# EAGLE design DRV8825 (EAGLE 7.2.0)
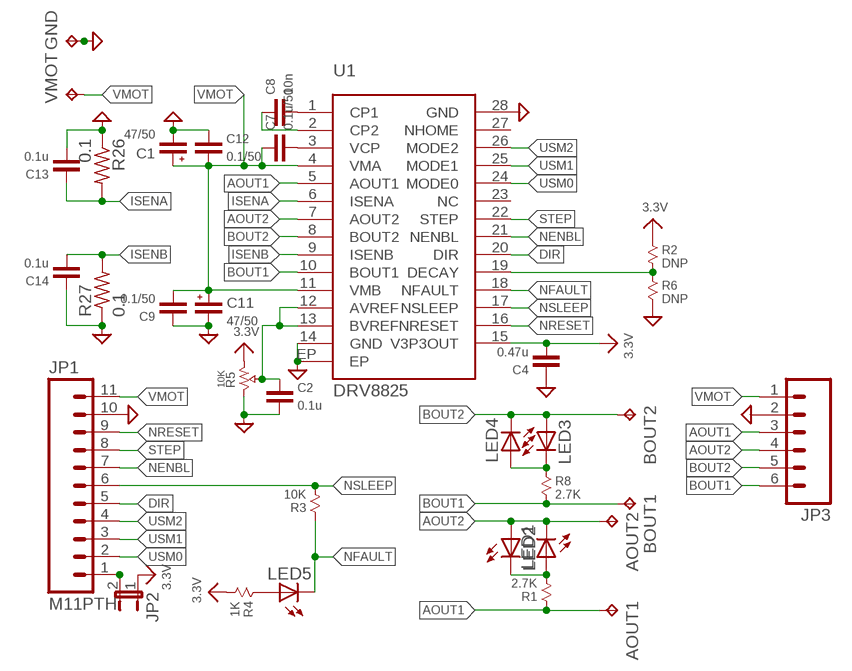
[diagram p0: schematic, sheet 1]

## Parts
AOUT1  TPTP18R  [TP18R]
AOUT2  TPTP18R  [TP18R]
BOUT1  TPTP18R  [TP18R]
BOUT2  TPTP18R  [TP18R]
C1  47/50  CAP-POL-7343  [CT7343]
C2  0.1u  CAP-0603  [0603]
C4  0.47u  CAP-0603  [0603]
C7  0.1u/50  CAP-0603  [0603]
C8  10n  CAP-0603  [0603]
C9  0.1/50  CAP-0603  [0603]
C11  47/50  CAP-POL-7343  [CT7343]
C12  0.1/50  CAP-0603  [0603]
C13  0.1u  CAP-0603  [0603]
C14  0.1u  CAP-0603  [0603]
GND  TPTP18R  [TP18R]
JP1  M11PTH  [1X11]
JP2  JUMPER-2SMD-NO  [SJ_2S-NO]
JP3  M06SIP  [1X06]
LED1  LEDCHIP-LED0603  [CHIP-LED0603]
LED2  LEDCHIP-LED0603  [CHIP-LED0603]
LED3  LEDCHIP-LED0603  [CHIP-LED0603]
LED4  LEDCHIP-LED0603  [CHIP-LED0603]
LED5  LEDCHIP-LED0603  [CHIP-LED0603]
R1  2.7K  RESISTOR-0603  [0603]
R2  DNP  RESISTOR-0603  [0603]
R3  10K  RESISTOR-0603  [0603]
R4  1K  RESISTOR-0603  [0603]
R5  10K  PVZ3A  [PVZ3A]
R6  DNP  RESISTOR-0603  [0603]
R8  2.7K  RESISTOR-0603  [0603]
R26  0.1  R-US_R2512  [R2512]
R27  0.1  R-US_R2512  [R2512]
U1  DRV8825  [SSOP28EP]
VMOT  TPTP18R  [TP18R]

## Nets
3.3V: C4.1 JP2.1 R2.1 R4.2 R5.3 U1.15(V3P3OUT)
AOUT1: AOUT1.TP JP3.3 R1.1 U1.5(AOUT1)
AOUT2: AOUT2.TP JP3.4 LED1.C LED2.A U1.7(AOUT2)
BOUT1: BOUT1.TP JP3.6 R8.2 U1.10(BOUT1)
BOUT2: BOUT2.TP JP3.5 LED3.A LED4.C U1.8(BOUT2)
DIR: JP1.5 U1.20(DIR)
GND: C1.- C2.1 C4.2 C9.2 C11.- C12.2 C13.1 C14.2 GND.TP JP1.10 JP3.2 R5.1 R6.2 R26.1 R27.1 U1.14(GND) U1.28(GND) U1.EP
ISENA: C13.2 R26.2 U1.6(ISENA)
ISENB: C14.1 R27.2 U1.9(ISENB)
N$1: C8.1 U1.1(CP1)
N$2: LED3.C LED4.A R8.1
N$3: LED1.A LED2.C R1.2
N$4: C8.2 U1.2(CP2)
N$5: LED5.A R4.1
N$7: C7.1 U1.3(VCP)
N$8: C2.2 R5.2 U1.12(AVREF) U1.13(BVREF)
N$12: R2.2 R6.1 U1.19(DECAY)
N$15: JP1.1 JP2.2
NENBL: JP1.7 U1.21(NENBL)
NFAULT: LED5.C R3.1 U1.18(NFAULT)
NRESET: JP1.9 U1.16(NRESET)
NSLEEP: JP1.6 R3.2 U1.17(NSLEEP)
STEP: JP1.8 U1.22(STEP)
USM0: JP1.2 U1.24(MODE0)
USM1: JP1.3 U1.25(MODE1)
USM2: JP1.4 U1.26(MODE2)
VMOT: C1.+ C7.2 C9.1 C11.+ C12.1 JP1.11 JP3.1 U1.4(VMA) U1.11(VMB) VMOT.TP
Unconnected: U1.23(NC) U1.27(NHOME)

## Library data of the parts
AOUT1 AOUT2 BOUT1 BOUT2 GND VMOT = testpad:TP: Test pad
C1 C11 = X893:CAP-POL
C2 C4 C7-C9 C12-C14 = X893:CAP: Capacitor
JP1 = SparkFun:M11: Header 11 Standard 11-pin 0.1" header. Use with straight break away headers (SKU : PRT-00116), right angle break away headers (PRT-00553), swiss pins (PRT-00743), machine pins (PRT-00117), and female headers (PRT-00115).
JP2 = SparkFun:JUMPER-2: Jumper Basic 0.1" spaced jumper. Use with breakaway headers.
JP3 = SparkFun:M06: Header 6 Standard 6-pin 0.1" header. Use with straight break away headers (SKU : PRT-00116), right angle break away headers (PRT-00553), swiss pins (PRT-00743), machine pins (PRT-00117), and female headers (PRT-00115). Molex polarized connector foot print use with SKU : PRT-08094 with associated crimp pins and housings. NOTES ON THE VARIANTS LOCK and LOCK_LONGPADS... This footprint was designed to help hold the alignment of a through-hole component (i.e. 6-pin header) while soldering it into place. You may notice that each hole has been shifted either up or down by 0.005 of an inch from it's more standard position (which is a perfectly straight line). This slight alteration caused the pins (the squares in the middle) to touch the edges of the holes. Because they are alternating, it causes a "brace" to hold the component in place. 0.005 has proven to be the perfect amount of "off-center" position when using our standard breakaway headers. Although looks a little odd when you look at the bare footprint, once you have a header in there, the alteration is very hard to notice. Also, if you push a header all the way into place, it is covered up entirely on the bottom side. This idea of altering the position of holes to aid alignment will be further integrated into the Sparkfun Library for other footprints. It can help hold any component with 3 or more connection pins.
LED1-LED5 = led:LED: LED OSRAM: - CHIPLED LG R971, LG N971, LY N971, LG Q971, LY Q971, LO R971, LY R971 LH N974, LH R974 LS Q976, LO Q976, LY Q976 LO Q996 - Hyper CHIPLED LW Q18S LB Q993, LB Q99A, LB R99A - SideLED LS A670, LO A670, LY A670, LG A670, LP A670 LB A673, LV A673, LT A673, LW A673 LH A674 LY A675 LS A676, LA A676, LO A676, LY A676, LW A676 LS A679, LY A679, LG A679 - Hyper Micro SIDELED® LS Y876, LA Y876, LO Y876, LY Y876 LT Y87S - SmartLED LW L88C, LW L88S LB L89C, LB L89S, LG L890 LS L89K, LO L89K, LY L89K LS L896, LA L896, LO L896, LY L896 - TOPLED LS T670, LO T670, LY T670, LG T670, LP T670 LSG T670, LSP T670, LSY T670, LOP T670, LYG T670 LG T671, LOG T671, LSG T671 LB T673, LV T673, LT T673, LW T673 LH T674 LS T676, LA T676, LO T676, LY T676, LB T676, LH T676, LSB T676, LW T676 LB T67C, LV T67C, LT T67C, LS T67K, LO T67K, LY T67K, LW E67C LS E67B, LA E67B, LO E67B, LY E67B, LB E67C, LV E67C, LT E67C LW T67C LS T679, LY T679, LG T679 LS T770, LO T770, LY T770, LG T770, LP T770 LB T773, LV T773, LT T773, LW T773 LH T774 LS E675, LA E675, LY E675, LS T675 LS T776, LA T776, LO T776, LY T776, LB T776 LHGB T686 LT T68C, LB T68C - Hyper Mini TOPLED® LB M676 - Mini TOPLED Santana® LG M470 LS M47K, LO M47K, LY M47K Source: http://www.osram.convergy.de LUXEON: - LUMILED® LXK2-PW12-R00, LXK2-PW12-S00, LXK2-PW14-U00, LXK2-PW14-V00 LXK2-PM12-R00, LXK2-PM12-S00, LXK2-PM14-U00 LXK2-PE12-Q00, LXK2-PE12-R00, LXK2-PE12-S00, LXK2-PE14-T00, LXK2-PE14-U00 LXK2-PB12-K00, LXK2-PB12-L00, LXK2-PB12-M00, LXK2-PB14-N00, LXK2-PB14-P00, LXK2-PB14-Q00 LXK2-PR12-L00, LXK2-PR12-M00, LXK2-PR14-Q00, LXK2-PR14-R00 LXK2-PD12-Q00, LXK2-PD12-R00, LXK2-PD12-S00 LXK2-PH12-R00, LXK2-PH12-S00 LXK2-PL12-P00, LXK2-PL12-Q00, LXK2-PL12-R00 Source: www.luxeon.com KINGBRIGHT: KA-3528ASYC Source: www.kingbright.com
R1-R4 R6 R8 = X893:RESISTOR
R5 = X893:PVZ3A: RESISTOR VARIABLE
R26 R27 = resistor:R-US_: RESISTOR, American symbol
U1 = X893:DRV8825: STEPPER MOTOR CONTROLLER IC http://www.ti.com/product/drv8825

## Board
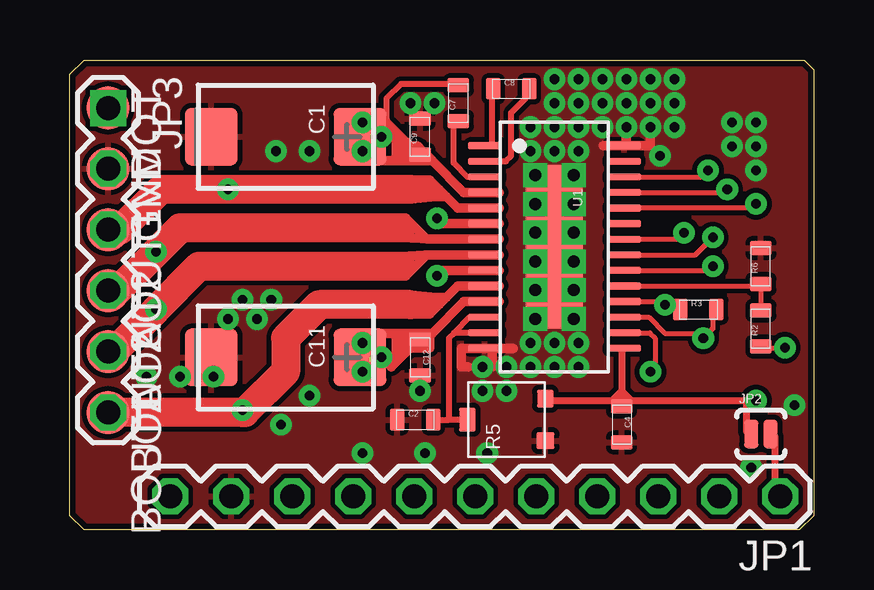
[diagram p1: board, top side]
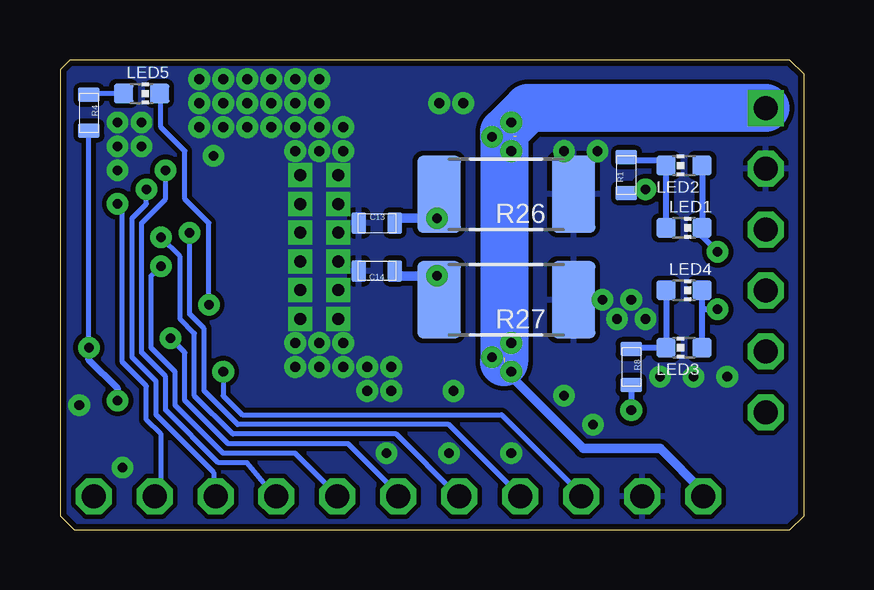
[diagram p2: board, bottom side, seen from below]

Size 31 x 19.6 mm. Coordinates in mm from the lower left corner, seen from the top.
Outline: 0.6,19.6 30.6,19.6 31,19.2 31,0.6 30.4,0 0.6,0 0,0.6 0,19 0.6,19.6
Copper layers (1+16): Top 0.035mm / dielectric 1.5mm / Bottom 0.035mm
Design rules "Rezonit": minimum track width 0.2mm, minimum drill 0.4mm, track to track 0.2mm, track to pad 0.2mm, pad to pad 0.2mm, via to via 0.2mm, smd to smd 0mil, copper to edge 0.25mm, drill to drill 0.4mm, minimum pad ring 0.25mm, minimum via ring 0.25mm, stop-mask expansion 4mil, vias tented up to drill 0.4mm, thermal gap 0.2mm

### Footprints (pad centres in the part's own frame; a part is rotated, then mirrored left to right if it is on the bottom)
TP18R = smd 1.8 x 1.8: TP 0,0
CT7343 = smd 2.2 x 2.4: + -3.1,0; - 3.1,0
0603 = smd 0.6 x 0.9: 1 -0.75,0; 2 0.75,0
1X11 = drill 1 pad 1.5 octagon: 1 0,0; 2 2.54,0; 3 5.08,0; 4 7.62,0; 5 10.16,0; 6 12.7,0; 7 15.24,0; 8 17.78,0; 9 20.32,0; 10 22.86,0; 11 25.4,0
SJ_2S-NO = smd 0.6 x 1.2: 1 -0.4,0; 2 0.4,0
1X06 = drill 1 pad 1.5 square: 1 0,0 | drill 1 pad 1.5 octagon: 2 2.54,0; 3 5.08,0; 4 7.62,0; 5 10.16,0; 6 12.7,0
CHIP-LED0603 = smd 0.8 x 0.8: A 0,-0.75; C 0,0.75
PVZ3A = smd 0.7 x 0.75: 1 -0.875,-1.625 | smd 1 x 0.7: 2 0,1.625 | smd 0.75 x 0.7: 3 0.875,-1.625
R2512 = smd 1.8 x 3.2: 1 -2.8,0; 2 2.8,0
SSOP28EP = smd 0.3 x 1.4: 1 -4.225,-2.9; 2 -3.575,-2.9; 3 -2.925,-2.9; 4 -2.275,-2.9; 5 -1.625,-2.9; 6 -0.975,-2.9; 7 -0.325,-2.9; 8 0.325,-2.9; 9 0.975,-2.9; 10 1.625,-2.9; 11 2.275,-2.9; 12 2.925,-2.9; 13 3.575,-2.9; 14 4.225,-2.9; 15 4.225,2.9; 16 3.575,2.9; 17 2.925,2.9; 18 2.275,2.9; 19 1.625,2.9; 20 0.975,2.9; 21 0.325,2.9; 22 -0.325,2.9; 23 -0.975,2.9; 24 -1.625,2.9; 25 -2.275,2.9; 26 -2.925,2.9; 27 -3.575,2.9; 28 -4.225,2.9 | smd 6.8 x 2.4: EP 0,0

### Placement (x,y rotation side)
AOUT1  1.6,12.52 270 top
AOUT2  1.6,9.98 270 top
BOUT1  1.6,4.9 270 top
BOUT2  1.6,7.44 270 top
C1  9,16.4 180 top
C2  14.4,4.6 0 top
C4  23,4.4 270 top
C7  16.2,17.8 90 top
C8  18.4,18.4 0 top
C9  14.6,16.4 90 top
C11  9,7.2 180 top
C12  14.6,7.2 270 top
C13  17.8,12.8 0 bottom
C14  17.8,10.8 180 bottom
GND  1.6,15.06 270 top
JP1  29.6,1.4 180 top
JP2  28.8,4 0 top
JP3  1.6,17.6 270 top
LED1  5,12.6 270 bottom
LED2  5,15.2 90 bottom
LED3  5,7.6 90 bottom
LED4  5,10 270 bottom
LED5  27.6,18.2 270 bottom
R1  7.4,14.8 90 bottom
R2  28.8,8.4 90 top
R3  26.2,9.2 0 top
R4  29.8,17.4 270 bottom
R5  18.2,4.6 90 top
R6  28.8,11 90 top
R8  7.2,6.8 270 bottom
R26  12.4,14 180 bottom
R27  12.4,9.6 180 bottom
U1  20.2,11.8 270 top
VMOT  1.6,17.6 270 top

### Tracks (layer width: path | path; a pad name or v marks a point on that pad's centre or on a via)
3.3V  (via drill 0.4)
  Top 0.2: v29.8,7.6 28.8,7.6 R2.1
  Top 0.25: 23,5.4 C4.1
  Top 0.3: R5.3 19.82,5.43 19.8,5.4 22.6,5.4 | 22.6,5.4 23,5.4 | 23,5.4 23.4,5.4 | 23.4,5.4 v28.6,5.4 28.2,5.4 28.2,4.11 JP2.1 | U1.15 23,7.58 23,5.8 | 23,5.8 23,5.4 | 23,5.8 22.6,5.4 | 23,5.8 23.4,5.4
  Bottom 0.2: v29.8,7.6 R4.2
  Bottom 0.3: v28.6,5.4 28.6,5.9 29.8,7.1 v29.8,7.6
AOUT1  (via drill 0.4)
  Top 0.4: 15.7,13.9 16.17,13.43 U1.5 17.9,13.43 | 15.7,13.9 15.4,14.2 | 15.4,14.2 15,14.6 13.4,14.6 | 15.7,13.9 15.3,13.9 14.2,13.8 | 15.4,14.2 14.2,14.2
  Top 1.2: 14.2,14.2 v6.6,14.2 3.8,14.2 2.12,12.52 JP3.3
  Bottom 0.25: R1.1 6.75,14.05 v6.6,14.2
AOUT2  (via drill 0.4)
  Top 0.2: 13.8,12.2 13.8,12.6
  Top 0.4: 15,12.12 U1.7 17.9,12.12 | 15,12.12 14.88,12.12 14,13 13.6,13 | 13.8,12.2 15,12.12
  Top 1.2: 13.8,12.6 4.6,12.6 v3.6,11.6 1.98,9.98 JP3.4
  Bottom 0.25: LED2.A LED1.C 4.25,12.25 v3.6,11.6
BOUT1  (via drill 0.4)
  Top 0.25: v7.2,5 7.2,4.9
  Top 0.4: 15.7,9.7 16.17,10.18 U1.10 17.9,10.18 | 15.7,9.7 15.4,9.4 | 15.4,9.4 15,9 14.2,9 | 15.7,9.7 15.3,9.7 14.2,9.8 | 15.4,9.4 14.2,9.4
  Top 1.2: 14.2,9.4 10.4,9.4 9,8 9,6.6 7.3,4.9 7.2,4.9 JP3.6
  Bottom 0.25: R8.2 v7.2,5
BOUT2  (via drill 0.4)
  Top 0.2: 14.88,11.48 14.81,11.48 14.8,11.46 | 14,10.6 14,10.8 13.8,11
  Top 0.4: 13.4,10.6 14,10.6 14.88,11.48 U1.8 17.9,11.48 | 13.8,11.4 14.8,11.46 15,11.48
  Top 1.2: JP3.5 1.84,7.44 v3.6,9.2 5.4,11 13.8,11
  Bottom 0.25: LED3.A 4.25,9.2 | 4.25,9.2 LED4.C | v3.6,9.2 4.25,9.2
DIR  (via drill 0.4)
  Top 0.2: U1.20 26.62,10.83 v26.8,11
  Bottom 0.2: JP1.5 19.44,1.44 21.2,3.2 24.2,3.2 26.2,5.2 26.2,6.6 27.2,7.6 27.2,10.6 v26.8,11
GND  (via drill 0.4, 0.5)
  Top 0.4: 16.6,6.8 16.32,6.8 16.32,7.58 17.6,7.58 | 17.6,6.8 17.6,7.58 | 17.6,7.58 18.47,7.58 | v24.2,16.8 24.2,16.02 23.2,16.02 | 23.2,16.02 22.22,16.02 | v23.2,16.8 23.2,16.02
  other vias: 15.2,17.8 4.6,6.4 6,6.4 6.6,8.8 7.8,8.8 8.4,9.6 3.2,6.4 10,15.8 8.6,15.8 7.2,9.6 10,5.6 8.8,4.4 14.6,5.8 22.2,16.8 24.6,15.6 22.2,17.8 19.4,14.8 21,14.8 21,12.4 21,13.6 19.4,13.6 19.4,12.4 19.4,11.2 21,11.2 21,10 19.4,10 21,8.8 19.4,8.8 20.2,6.8 21.2,7.8 19.2,6.8 21.2,6.8 20.2,7.8 21.2,17.8 20.2,17.8 20.2,15.8 21.2,15.8 19.2,15.8 21.2,16.8 20.2,16.8 23.2,17.8 24.2,17.8 19.2,16.8 18.2,5.8 17.2,5.8 19.2,7.8 28.4,2.6 30.2,5.2 25.2,17.8 25.2,16.8 27.6,17 28.6,17 28.6,16 27.6,16 28.6,15 14.8,3.2 12.2,3.2 17.4,3.2 14.2,17.8 20.2,18.8 21.2,18.8 22.2,18.8 23.2,18.8 24.2,18.8 25.2,18.8 18.2,6.8 17.2,6.8
  pour Top (isolate 0.2, rank 2): 0,19.6 0,0 31,0 31,19.6
  pour Bottom: 0,19.6 0,0 31,0 31,19.6
ISENA  (via drill 0.4)
  Top 0.4: U1.6 16.12,12.78 | 16.12,12.78 15.52,12.78 v15.3,13 | 17.9,12.78 16.12,12.78
  Bottom 0.4: C13.2 16.85,13 v15.3,13 15.2,13 R26.2
ISENB  (via drill 0.4)
  Top 0.4: U1.9 16.12,10.83 | 16.12,10.83 15.52,10.83 v15.3,10.6 | 17.9,10.83 16.12,10.83
  Bottom 0.4: R27.2 15.2,10.6 v15.3,10.6 17.05,10.6 C14.1
N$1
  Top 0.25: 17.22,16.02 U1.1 17.6,16.02 17.6,18.35 C8.1
N$2
  Bottom 0.25: LED4.A LED3.C 7.15,7.6 R8.1
N$3
  Bottom 0.25: LED1.A LED2.C 5.75,15.35 5.8,15.4 7.35,15.4 R1.2
N$4
  Top 0.25: U1.2 18.18,15.38 18.4,15.6 18.4,17.4 19,18 19,18.35 C8.2
N$5
  Bottom 0.2: LED5.A 29.75,18.2 R4.1
N$7
  Top 0.25: U1.3 16.57,14.73 16,15.3 16,16.85 C7.1
N$8
  Top 0.25: 15.8,4.6 15.8,8 16.02,8.23 | U1.12 16.68,8.88 16.02,8.23 | U1.13 16.02,8.23 | R5.2 15.8,4.6 | C2.2 15.8,4.6
N$12
  Top 0.2: U1.19 28.8,10.18 | 28.8,10.18 R2.2 | R6.1 28.8,10.18
N$15
  Top 0.3: JP1.1 29.4,1.6 29.4,3.89 JP2.2
NENBL  (via drill 0.4)
  Top 0.2: U1.21 26.07,11.48 v26.8,12.2
  Bottom 0.2: JP1.7 14.4,1.4 17,4 23.8,4 25.4,5.6 25.4,8.2 26,8.8 26,11.4 v26.8,12.2
NFAULT  (via drill 0.4)
  Top 0.2: U1.18 24.8,9.53 | 24.8,9.53 25.45,9.53 R3.1 | v24.8,9.4 24.8,9.53
  Bottom 0.2: v24.8,9.4 24.8,12.8 25.8,13.8 25.8,15.8 26.8,16.8 26.8,18.15 LED5.C
NRESET  (via drill 0.4)
  Top 0.2: U1.16 24.18,8.23 24.4,8 24.4,6.8 v24.2,6.6
  Bottom 0.2: v24.2,6.6 24.2,5.6 23.4,4.8 12.6,4.8 9.6,1.8 9.6,1.72 JP1.9
NSLEEP  (via drill 0.4)
  Top 0.2: U1.17 24.12,8.88 24.8,8.2 26.2,8.2 v26.4,8 26.8,8.4 26.8,9 26.95,9.25 R3.2
  Bottom 0.2: JP1.6 16.9,1.5 19,3.6 24,3.6 25.8,5.4 25.8,7.4 v26.4,8
STEP  (via drill 0.4)
  Top 0.2: U1.22 25.32,12.12 v25.6,12.4
  Bottom 0.2: JP1.8 11.82,1.42 14.8,4.4 23.6,4.4 25,5.8 25,8.4 25.6,9 v25.6,12.4
USM0  (via drill 0.4)
  Top 0.2: v28.6,13.6 28.38,13.43 U1.24
  Bottom 0.2: v28.6,13.6 28.4,13.4 28.4,7 27.4,6 27.4,4.6 26.8,4 26.8,1.66 JP1.2
USM1  (via drill 0.4)
  Top 0.2: U1.25 27.27,14.08 v27.4,14.2
  Bottom 0.2: v27.4,14.2 27.4,13.6 28,13 28,7.2 27,6.2 27,4.8 24.6,2.4 24.6,1.48 JP1.3
USM2  (via drill 0.4)
  Top 0.2: U1.26 26.32,14.73 v26.6,15
  Bottom 0.2: JP1.4 22.18,1.6 | 22.2,1.6 23.2,2.8 24.4,2.8 26.6,5 26.6,6.4 27.6,7.4 27.6,12.8 26.6,13.8 v26.6,15
  Bottom 0.25: 22.18,1.6 22.2,1.6
VMOT  (via drill 0.4)  (2 unrouted)
  Top 0.25: C7.2 16.2,18.6 13.8,18.6 13.2,18 13.2,17 | 12.5,7.2 C11.+ v13,7.2
  Top 0.4: 15.1,15.4 16.43,14.08 U1.4 17.9,14.08 | 15.1,8.2 16.43,9.53 U1.11 17.9,9.53 | 15.1,8.2 14,8.2 | 14,8.2 13.6,8.2 | 13.6,8.2 13,8.2 | 15.1,8.2 15,8.1 15,7.6 14.6,7.6 | 14.6,7.6 14.2,7.6 14,7.4 | 14,7.4 13.4,6.8 v13,7.2 | 13.6,8.2 13.6,7.2 | 14,8.2 14,7.4 | C12.1 14.6,7.6 | 15.1,15.4 14,15.4 | 14,15.4 13.6,15.4 | 13.6,15.4 12.8,15.4 | 15.1,15.4 14.65,15.85 | 14.65,15.85 14.5,16 14.2,16 14,16.2 | 14,16.2 13.2,17 12.8,17 v13,16.4 | C9.1 14.65,15.7 14.65,15.85 | 13.6,15.4 13.6,16.4 | 14,15.4 14,16.2
  Bottom 0.3: v12.2,7.8 v13,7.2 v12.2,6.6 | v12.2,17 12,16.4 | 12,16.4 v12.2,15.8 | 12,16.4 12.5,16.4 v13,16.4
  Bottom 0.4: JP1.11 4.2,1.6 6,3.4 9.2,3.4 12.2,6.4 v12.2,6.6
  Bottom 2: 12.5,7 12.5,16.4 12.5,16.6 11.5,17.6 JP3.1

### Text on the board
Reference: VMOT | GND | AOUT1 | AOUT2 | BOUT2 | BOUT1 | VMOT | GND | RESETn | STEP | ENABLEn | SLEEPn | DIR | USM2 | USM1 | USM0 | +3.3V